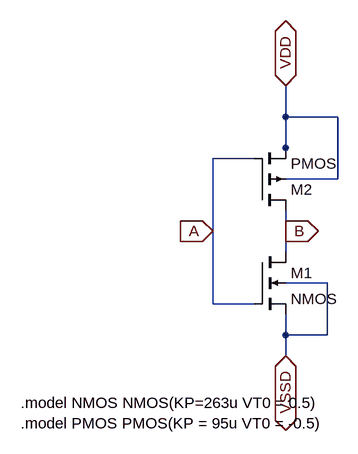
[diagram p0: schematic my_inverter_1GHz.asc]
my_inverter_1GHz.asc, the LTspice schematic file:
Version 4
SHEET 1 880 680
WIRE 272 16 272 -32
WIRE 352 16 272 16
WIRE 272 64 272 16
WIRE 224 80 160 80
WIRE 272 80 272 64
WIRE 352 112 352 16
WIRE 352 112 272 112
WIRE 160 192 160 80
WIRE 272 192 272 160
WIRE 272 224 272 192
WIRE 336 272 272 272
WIRE 160 304 160 192
WIRE 224 304 160 304
WIRE 272 352 272 320
WIRE 336 352 336 272
WIRE 336 352 272 352
WIRE 272 384 272 352
FLAG 272 -32 VDD
IOPIN 272 -32 BiDir
FLAG 160 192 A
IOPIN 160 192 In
FLAG 272 192 B
IOPIN 272 192 Out
FLAG 272 384 VSSD
IOPIN 272 384 BiDir
SYMBOL nmos4 224 224 R0
SYMATTR InstName M1
SYMATTR Value2 l=180n w=1.6u
SYMBOL pmos4 224 160 M180
SYMATTR InstName M2
SYMATTR Value2 l=180n w=4.6u
TEXT -136 456 Left 2 !.model NMOS NMOS(KP=263u VT0 = 0.5)
TEXT -136 488 Left 2 !.model PMOS PMOS(KP = 95u VT0 = -0.5)

The netlist it stands for:
* my_inverter_1GHz.asc
M1 B A VSSD VSSD NMOS l=180n w=1.6u
M2 B A VDD VDD PMOS l=180n w=4.6u
.model NMOS NMOS
.model PMOS PMOS
.lib standard.mos
.model NMOS NMOS(KP=263u VT0 = 0.5)
.model PMOS PMOS(KP = 95u VT0 = -0.5)
.backanno
.end